# EAGLE design JackPots (EAGLE 6.6.0)
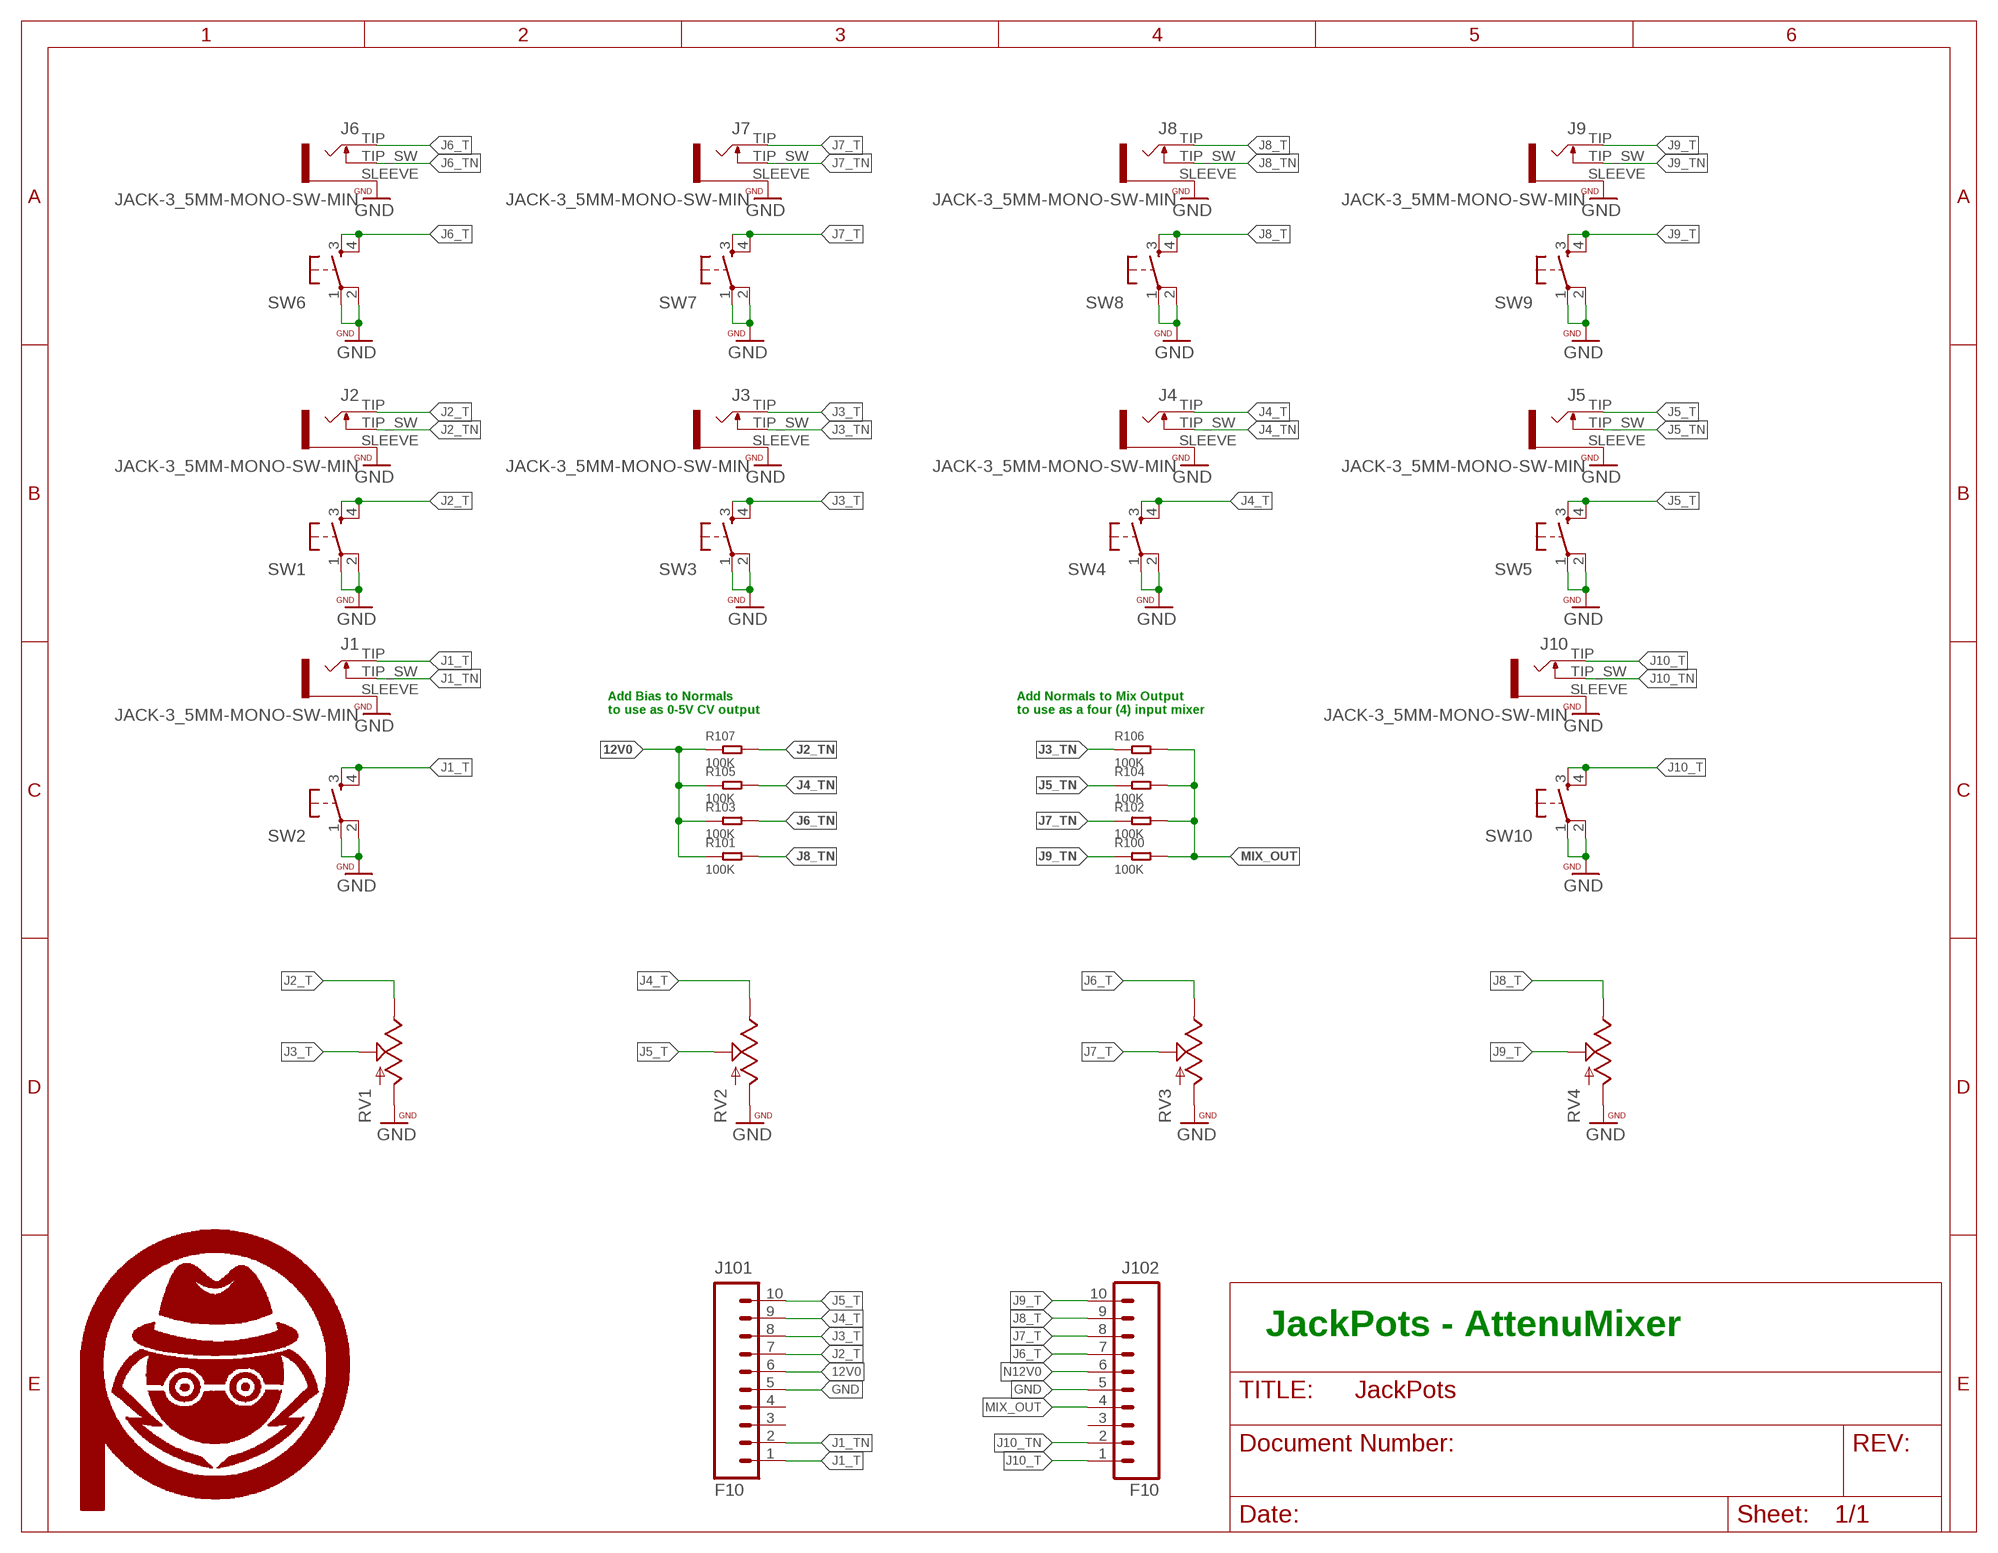
[diagram p0: schematic, sheet 1]

## Parts
$$U$1  PA_LOGO_SYMSMALL  [PA_LOGO_AGENT_SMALL_SYM]
$$U$100  PA_LOGO_SYMMED  [PA_LOGO_AGENT_MED_SYM]
$$U$101  PA_LOGO_SYMMED  [PA_LOGO_AGENT_MED_SYM]
J1  JACK-3_5MM-MONO-SW-MIN  [WQP_PJ301M-MIN]
J2  JACK-3_5MM-MONO-SW-MIN  [WQP_PJ301M-MIN]
J3  JACK-3_5MM-MONO-SW-MIN  [WQP_PJ301M-MIN]
J4  JACK-3_5MM-MONO-SW-MIN  [WQP_PJ301M-MIN]
J5  JACK-3_5MM-MONO-SW-MIN  [WQP_PJ301M-MIN]
J6  JACK-3_5MM-MONO-SW-MIN  [WQP_PJ301M-MIN]
J7  JACK-3_5MM-MONO-SW-MIN  [WQP_PJ301M-MIN]
J8  JACK-3_5MM-MONO-SW-MIN  [WQP_PJ301M-MIN]
J9  JACK-3_5MM-MONO-SW-MIN  [WQP_PJ301M-MIN]
J10  JACK-3_5MM-MONO-SW-MIN  [WQP_PJ301M-MIN]
J101  F10  M10SILK_FEMALE_PTH  [1X10_OCTO]
J102  F10  M10SILK_FEMALE_PTH  [1X10_OCTO]
R100  100K  SMD-RES-100K-1%-1/10W(0603)  [R0603]
R101  100K  SMD-RES-100K-1%-1/10W(0603)  [R0603]
R102  100K  SMD-RES-100K-1%-1/10W(0603)  [R0603]
R103  100K  SMD-RES-100K-1%-1/10W(0603)  [R0603]
R104  100K  SMD-RES-100K-1%-1/10W(0603)  [R0603]
R105  100K  SMD-RES-100K-1%-1/10W(0603)  [R0603]
R106  100K  SMD-RES-100K-1%-1/10W(0603)  [R0603]
R107  100K  SMD-RES-100K-1%-1/10W(0603)  [R0603]
RV1  POT  [ALPS_POT]
RV2  POT  [ALPS_POT]
RV3  POT  [ALPS_POT]
RV4  POT  [ALPS_POT]
SW1  TAC_SWITCHPTH  [TACTILE-PTH]
SW2  TAC_SWITCHPTH  [TACTILE-PTH]
SW3  TAC_SWITCHPTH  [TACTILE-PTH]
SW4  TAC_SWITCHPTH  [TACTILE-PTH]
SW5  TAC_SWITCHPTH  [TACTILE-PTH]
SW6  TAC_SWITCHPTH  [TACTILE-PTH]
SW7  TAC_SWITCHPTH  [TACTILE-PTH]
SW8  TAC_SWITCHPTH  [TACTILE-PTH]
SW9  TAC_SWITCHPTH  [TACTILE-PTH]
SW10  TAC_SWITCHPTH  [TACTILE-PTH]

## Nets
12V0: J101.6 R101.1 R103.1 R105.1 R107.1
GND: J1.SLEEVE J2.SLEEVE J3.SLEEVE J4.SLEEVE J5.SLEEVE J6.SLEEVE J7.SLEEVE J8.SLEEVE J9.SLEEVE J10.SLEEVE J101.5 J102.5 RV1.P$3 RV2.P$3 RV3.P$3 RV4.P$3 SW1.1 SW1.2 SW2.1 SW2.2 SW3.1 SW3.2 SW4.1 SW4.2 SW5.1 SW5.2 SW6.1 SW6.2 SW7.1 SW7.2 SW8.1 SW8.2 SW9.1 SW9.2 SW10.1 SW10.2
J1_T: J1.TIP J101.1 SW2.3 SW2.4
J1_TN: J1.TIP_SW J101.2
J2_T: J2.TIP J101.7 RV1.P$1 SW1.3 SW1.4
J2_TN: J2.TIP_SW R107.2
J3_T: J3.TIP J101.8 RV1.P$2 SW3.3 SW3.4
J3_TN: J3.TIP_SW R106.1
J4_T: J4.TIP J101.9 RV2.P$1 SW4.3 SW4.4
J4_TN: J4.TIP_SW R105.2
J5_T: J5.TIP J101.10 RV2.P$2 SW5.3 SW5.4
J5_TN: J5.TIP_SW R104.1
J6_T: J6.TIP J102.7 RV3.P$1 SW6.3 SW6.4
J6_TN: J6.TIP_SW R103.2
J7_T: J7.TIP J102.8 RV3.P$2 SW7.3 SW7.4
J7_TN: J7.TIP_SW R102.1
J8_T: J8.TIP J102.9 RV4.P$1 SW8.3 SW8.4
J8_TN: J8.TIP_SW R101.2
J9_T: J9.TIP J102.10 RV4.P$2 SW9.3 SW9.4
J9_TN: J9.TIP_SW R100.1
J10_T: J10.TIP J102.1 SW10.3 SW10.4
J10_TN: J10.TIP_SW J102.2
MIX_OUT: J102.4 R100.2 R102.2 R104.2 R106.2
N12V0: J102.6
Unconnected: J101.3 J101.4 J102.3

## Notes on the sheet
- Add Bias to Normals
  to use as 0-5V CV output
- Add Normals to Mix Output
  to use as a four (4) input mixer
- JackPots - AttenuMixer

## Library data of the parts
$$U$1 $$U$100 $$U$101 = PatternAgents-Logos:PA_LOGO_SYM: PatternAgents Logo Symbol Trademark : PatternAgents, LLC Github : https://github.com/PatternAgents/PCB_Libraries License : http://creativecommons.org/licenses/by-sa/3.0/ (Creative Commons 3.0) THIS SOFTWARE IS PROVIDED BY THE CONTRIBUTORS "AS IS" AND WITHOUT ANY EXPRESS OR IMPLIED WARRANTIES, INCLUDING, BUT NOT LIMITED TO, THE IMPLIED WARRANTIES OF MERCHANTABILITY AND FITNESS FOR A PARTICULAR PURPOSE ARE DISCLAIMED. IN NO EVENT SHALL THE COPYRIGHT OWNER OR CONTRIBUTORS BE LIABLE FOR ANY DIRECT, INDIRECT, INCIDENTAL, SPECIAL, EXEMPLARY, OR CONSEQUENTIAL DAMAGES (INCLUDING, BUT NOT LIMITED TO, PROCUREMENT OF SUBSTITUTE GOODS OR SERVICES; LOSS OF USE, DATA, OR PROFITS; OR BUSINESS INTERRUPTION) HOWEVER CAUSED AND ON ANY THEORY OF LIABILITY, WHETHER IN CONTRACT, STRICT LIABILITY, OR TORT (INCLUDING NEGLIGENCE OR OTHERWISE) ARISING IN ANY WAY OUT OF THE USE OF THIS SOFTWARE, EVEN IF ADVISED OF THE POSSIBILITY OF SUCH DAMAGE.
J1-J10 = halcyonmod_Connectors:JACK-3_5MM-MONO-SW: Jack, 3.5mm, RIght Angle, Though-Hole
J101 J102 = oXo_Connectors:M10: Header 10 Standard 10-pin 0.1" header. Use with straight break away headers (SKU : PRT-00116), right angle break away headers (PRT-00553), swiss pins (PRT-00743), machine pins (PRT-00117), and female headers (PRT-00115).; PROD_ID: CONN-11563
R100-R107 = Seeed-Resistor-2016:SMD-RES-100K-1%-1/10W(0603): 301010196; MPN: RC0603FR-07100KL
RV1-RV4 = halcyonmod_Potentiometers:POT; PROD_ID: RES-09177
SW1-SW10 = SparkFun:TAC_SWITCH: Momentary Switch Button commonly used for reset or general input. Spark Fun Electronics SKU : COM-00097

## Board
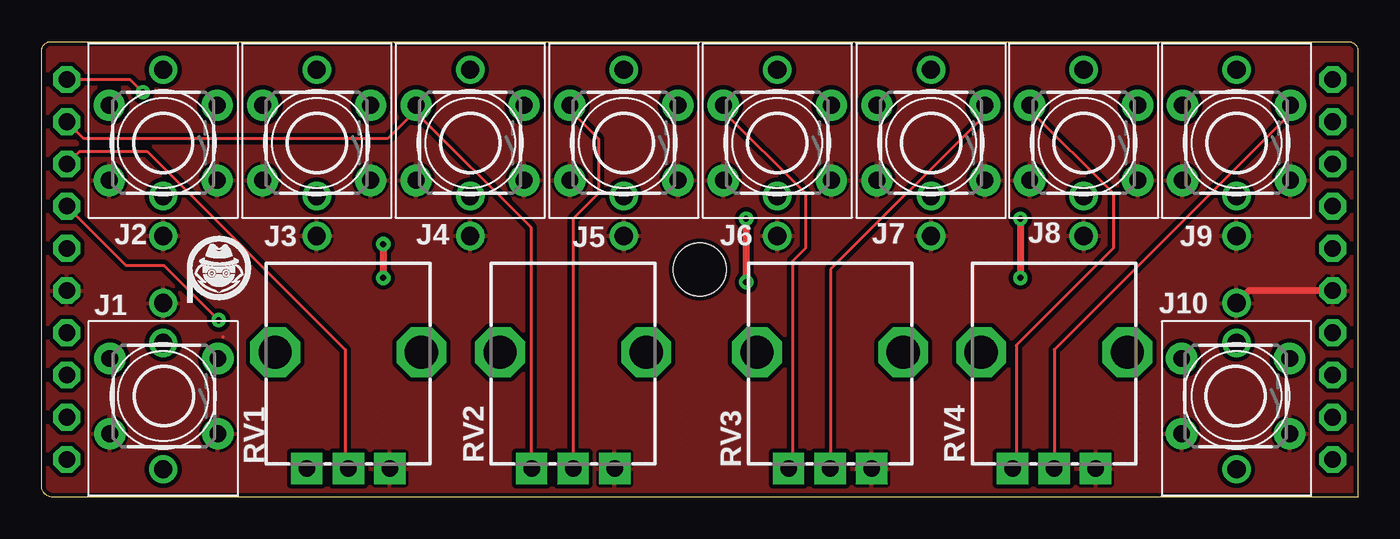
[diagram p1: board, top side]
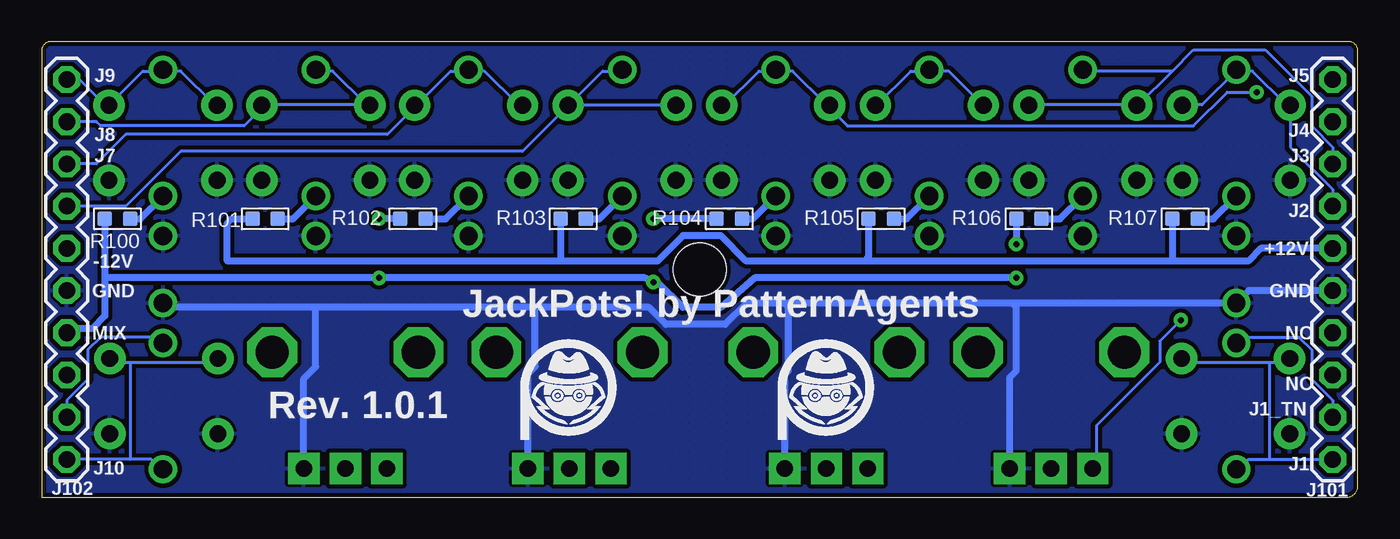
[diagram p2: board, bottom side, seen from below]

Size 79.25 x 27.43 mm. Coordinates in mm from the lower left corner, seen from the top.
Outline: 79.25,0 0.72,0 arc-90 0,0.72 0,26.86 arc-90 0.57,27.43 78.68,27.43 arc-90 79.25,26.86 79.25,0
Copper layers (1*16): Top 0.035mm / dielectric 1.5mm / Bottom 0.035mm
Design rules "PatternAgents_7mil": minimum track width 7mil, minimum drill 14mil, track to track 7mil, track to pad 7mil, pad to pad 7mil, via to via 7mil, smd to smd 7mil, copper to edge 7mil, drill to drill 7mil, minimum pad ring 12mil, minimum via ring 10mil, stop-mask expansion 4mil, vias tented up to drill 25mil, thermal gap 7mil
Holes 3.2 mm at 39.62,13.72

### Footprints (pad centres in the part's own frame; a part is rotated, then mirrored left to right if it is on the bottom)
WQP_PJ301M-MIN = drill 1.1: SLEEVE 0,-5.6; TIP 0,4.4; TIP_SW 0,-3.2
1X10_OCTO = drill 1 octagon: 1 0,0; 2 2.54,0; 3 5.08,0; 4 7.62,0; 5 10.16,0; 6 12.7,0; 7 15.24,0; 8 17.78,0; 9 20.32,0; 10 22.86,0
R0603 = smd 0.889 x 0.889: 1 0,0.762; 2 0,-0.762
ALPS_POT = drill 1 pad 1.88 square: P$1 7,-2.5; P$2 7,0; P$3 7,2.5 | drill 2 octagon: P$4 0,-4.4; P$5 0,4.4
TACTILE-PTH = drill 1.016 pad 1.88: 1 -3.251,2.261; 2 3.251,2.261; 3 -3.251,-2.261; 4 3.251,-2.261

### Placement (x,y rotation side)
$$U$1  10.67,13.46 0 top
$$U$100  47.5,6.1 0 bottom
$$U$101  32,6.1 0 bottom
J1  7.32,6.1 180 top
J2  7.32,21.34 0 top
J3  16.56,21.34 0 top
J4  25.8,21.34 0 top
J5  35.05,21.34 0 top
J6  44.29,21.34 0 top
J7  53.54,21.34 0 top
J8  62.73,21.34 0 top
J9  71.93,21.34 0 top
J10  71.93,6.1 180 top
J101  1.52,2.29 90 bottom
J102  77.72,2.29 90 bottom
R100  74.68,16.76 270 bottom
R101  65.79,16.76 90 bottom
R102  56.9,16.76 270 bottom
R103  47.24,16.76 90 bottom
R104  37.85,16.76 270 bottom
R105  28.7,16.76 90 bottom
R106  19.81,16.76 270 bottom
R107  10.41,16.76 90 bottom
RV1  18.47,8.74 270 top
RV2  32,8.74 270 top
RV3  47.47,8.74 270 top
RV4  60.96,8.74 270 top
SW1  7.32,21.34 180 top
SW2  7.37,6.1 180 top
SW3  16.56,21.34 180 top
SW4  25.8,21.34 180 top
SW5  35.05,21.34 180 top
SW6  44.29,21.34 180 top
SW7  53.54,21.34 180 top
SW8  62.73,21.34 180 top
SW9  71.93,21.34 180 top
SW10  71.88,6.1 180 top

### Tracks (layer width: path | path; a pad name or v marks a point on that pad's centre or on a via)
12V0
  Bottom 0.406: J101.6 5.84,14.99 6.6,14.22 11.18,14.22 | 11.18,14.22 29.72,14.22 | 29.72,14.22 36.83,14.22 38.35,15.75 40.64,15.75 42.16,14.22 48.01,14.22 | 48.01,14.22 68.07,14.22 68.07,16.51 67.82,16.76 R101.1 | R107.1 11.18,14.22 | R105.1 29.46,14.48 29.72,14.22 | R103.1 48.01,14.22
GND
  Top 0.178: 10.92,9.65 10.93,9.66
  Top 0.406: J102.5 72.68,12.45 J10.SLEEVE
  Bottom 0.406: J101.5 6.57,12.45 J1.SLEEVE 20.83,11.7 | 20.83,11.7 34.54,11.7 | 34.54,11.7 36.82,11.7 38.1,10.41 41.66,10.41 42.67,11.43 49.53,11.43 | 49.53,11.43 62.74,11.43 | 62.74,11.43 71.67,11.43 J10.SLEEVE | RV1.P$3 20.97,7.23 20.57,7.62 20.57,11.44 20.83,11.7 | RV2.P$3 34.5,7.41 34.29,7.62 34.29,11.44 34.54,11.7 | RV3.P$3 49.97,7.43 49.53,7.87 49.53,11.43 | RV4.P$3 63.46,7.15 62.74,7.87 62.74,11.43
  pour Bottom (isolate 0.254, hatched): 0,0 0,27.43 79.25,27.43 79.25,0
  pour Top (isolate 0.254, hatched): 0,0 0,27.43 79.25,27.43 79.25,0
J1_T
  Bottom 0.178: 5.33,2.29 6.6,2.29 7.11,1.78 J1.TIP | 5.33,2.29 J101.1 | 5.33,8.13 10.41,8.13 SW2.3 | 5.33,8.13 4.32,8.13 SW2.4 | 5.33,8.13 5.33,2.29
J1_TN
  Bottom 0.178: J101.2 1.52,5.84 2.79,7.11 2.79,8.89 3.56,9.65 6.86,9.65 7.11,9.4 J1.TIP_SW
J2_T  (via drill 0.36)
  Top 0.178: v10.67,10.67 7.37,13.97 5.08,13.97 J101.7
  Bottom 0.178: J101.7 1.52,18.54 4.06,21.08 4.06,23.37 SW1.4 4.32,23.62 6.35,25.65 7.11,25.65 J2.TIP 7.37,25.65 9.4,23.62 10.41,23.62 SW1.3 | v10.67,10.67 11.94,9.4 11.94,8.13 15.75,4.32 15.75,1.78 RV1.P$1
J2_TN
  Bottom 0.406: R107.2 8.7,16.76 J2.TIP_SW
J3_T
  Top 0.178: J101.8 2.29,20.83 6.35,20.83 18.29,8.89 18.29,1.78 RV1.P$2
  Bottom 0.178: J101.8 1.52,21.08 2.79,22.35 2.79,24.13 5.59,26.92 9.91,26.92 11.18,25.65 | 11.18,25.65 13.21,23.62 SW3.4 13.46,23.62 19.81,23.62 SW3.3 | 11.18,25.65 16.51,25.65 J3.TIP
J3_TN
  Bottom 0.406: R106.1 17.94,16.76 J3.TIP_SW
J4_T
  Top 0.178: J101.9 2.54,21.59 20.83,21.59 22.61,23.37 SW4.4 22.35,23.37 29.46,16.26 29.46,1.78 RV2.P$1
  Bottom 0.178: SW4.3 28.96,23.62 26.92,25.65 25.91,25.65 J4.TIP 25.65,25.65 24.64,25.65 22.61,23.62 SW4.4
J4_TN
  Bottom 0.406: R105.2 27.18,16.76 J4.TIP_SW
J5_T  (via drill 0.36)
  Top 0.178: J101.10 5.33,25.15 v6.1,24.38 | RV2.P$2 32,16.76 33.53,18.29 33.53,21.59 31.75,23.37 SW5.4
  Bottom 0.178: SW5.3 38.1,23.62 36.07,25.65 35.31,25.65 J5.TIP 35.05,25.65 34.04,25.65 32,23.62 SW5.4 31.75,23.37 30.73,22.35 9.91,22.35 7.87,24.38 v6.1,24.38
J5_TN
  Bottom 0.406: R104.1 36.43,16.76 J5.TIP_SW
J6_T
  Top 0.178: RV3.P$1 45.21,1.78 45.21,14.22 45.97,14.99 45.97,18.29 40.89,23.37 SW6.4
  Bottom 0.178: J102.7 74.17,17.53 70.87,20.83 50.29,20.83 47.75,23.37 SW6.3 47.5,23.62 | 47.5,23.62 45.47,25.65 44.45,25.65 J6.TIP | 47.5,23.62 41.15,23.62 SW6.4
J6_TN
  Bottom 0.406: R103.2 45.67,16.76 J6.TIP_SW
J7_T
  Top 0.178: RV3.P$2 47.5,1.78 47.5,13.72 56.64,22.86 56.64,23.37 SW7.3
  Bottom 0.178: SW7.4 50.55,23.62 52.58,25.65 53.34,25.65 J7.TIP 53.59,25.65 54.61,25.65 56.64,23.62 SW7.3 56.9,23.37 58.42,21.84 74.17,21.84 75.95,20.07 J102.8
J7_TN
  Bottom 0.406: R102.1 54.92,16.76 J7.TIP_SW
J8_T
  Top 0.178: RV4.P$1 58.67,1.78 58.67,9.14 64.52,14.99 64.52,18.29 59.44,23.37 SW8.4
  Bottom 0.178: J102.9 75.95,22.61 75.69,22.35 67.06,22.35 66.04,23.37 SW8.3 65.79,23.62 59.69,23.62 | 59.69,23.62 61.72,25.65 62.48,25.65 J8.TIP | 59.69,23.62 SW8.4
J8_TN
  Bottom 0.406: R101.2 64.11,16.76 J8.TIP_SW
J9_T
  Top 0.178: RV4.P$2 60.96,8.89 75.44,23.37 SW9.3
  Bottom 0.178: SW9.4 68.83,23.62 70.87,25.65 71.88,25.65 J9.TIP 72.14,25.65 73.15,25.65 75.18,23.62 SW9.3 75.44,23.62 76.96,25.15 J102.10
J9_TN
  Bottom 0.406: R100.1 73.31,16.76 J9.TIP_SW
J10_T
  Bottom 0.178: 73.91,2.29 72.64,2.29 72.14,1.78 J10.TIP | 73.91,2.29 J102.1 | 73.91,8.13 74.93,8.13 SW10.3 | 73.91,8.13 68.83,8.13 SW10.4 | 73.91,8.13 73.91,2.29
J10_TN
  Bottom 0.178: J102.2 77.72,5.84 76.45,7.11 76.45,8.89 75.69,9.65 72.39,9.65 72.14,9.4 J10.TIP_SW
MIX_OUT  (via drill 0.36)
  Top 0.406: v20.57,15.24 v20.57,13.21 | v42.42,16.76 v42.42,12.95 | v58.93,16.76 v58.93,13.21
  Bottom 0.406: R106.2 v20.57,15.24 | v20.57,13.21 36.32,13.21 38.35,11.43 40.64,11.43 42.16,12.95 v42.42,12.95 42.93,13.21 v58.93,13.21 75.44,13.21 | R100.2 75.44,13.21 | R104.2 v42.42,16.76 | 75.44,13.21 75.44,10.92 76.2,10.16 77.47,10.16 J102.4 | R102.2 v58.93,16.76

### Text on the board
bPlace: J5 | J9 | J4 | J8 | J3 | J7 | J2 | +12V | -12V | GND | GND | JackPots! by PatternAgents | NC | MIX | NC | J1_TN | Rev. 1.0.1 | J1 | J10